# Altium schematic sheet MCU02.SchDoc
size A4
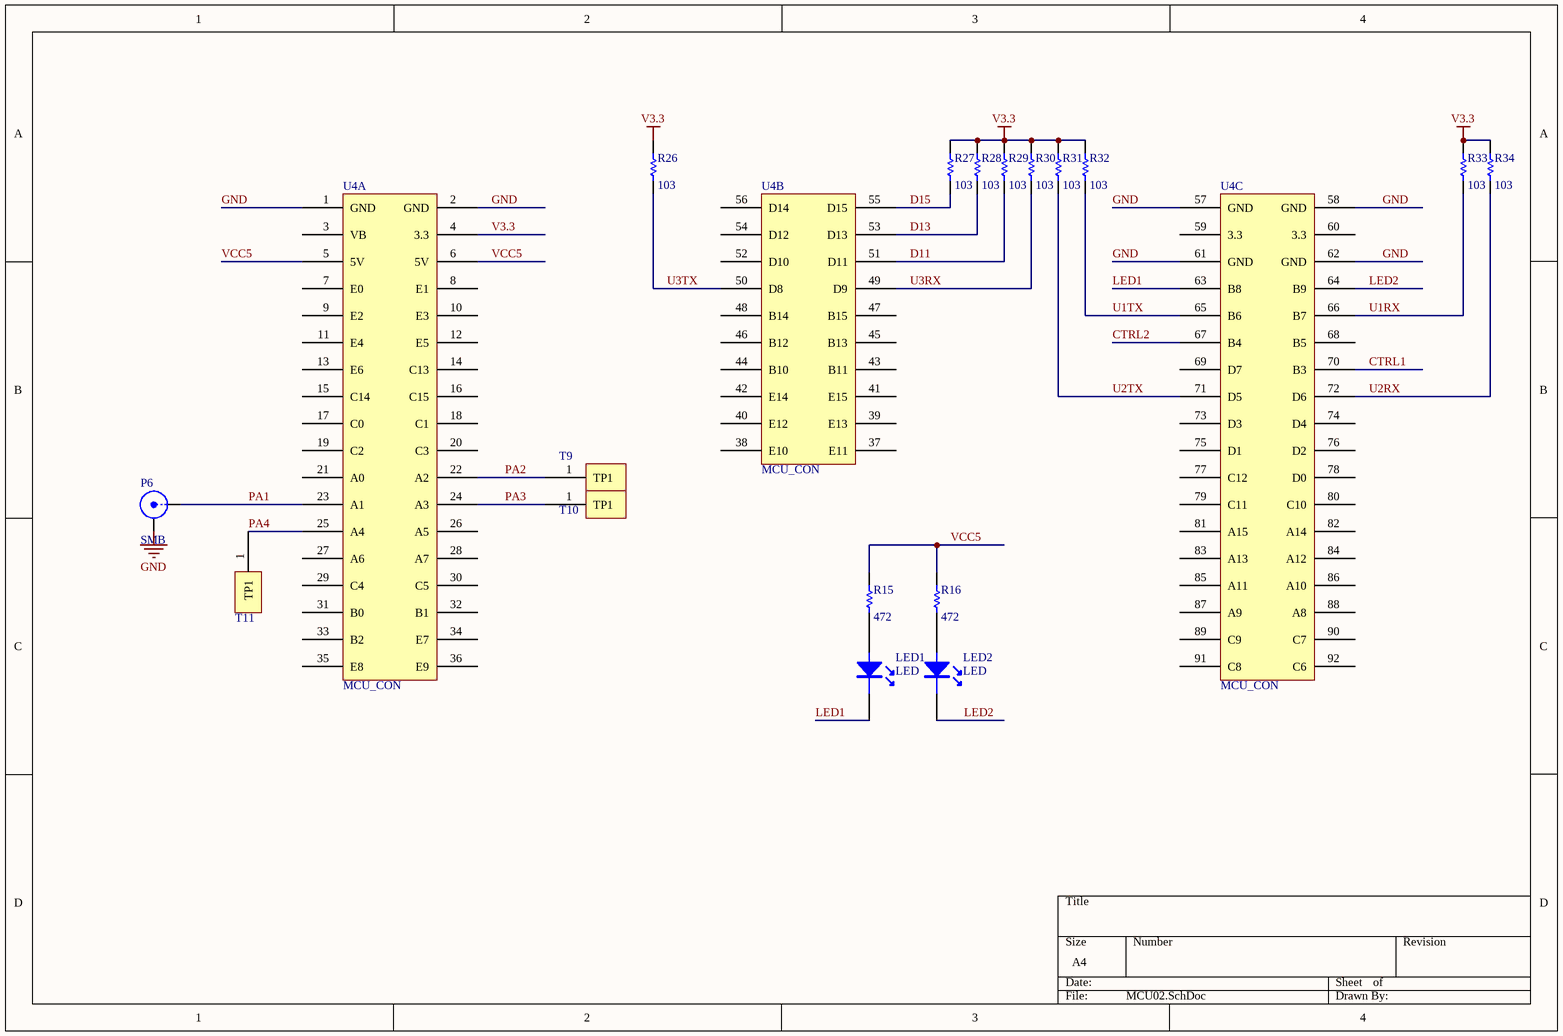
[diagram p0: MCU02.SchDoc]

## Parts
LED1  LED  [0805_LED]
LED2  LED  [0805_LED]
P6  SMB  [SMB_V-RJ45]
R15  value 472  [1206]  (hidden comment: Res Semi)
R16  value 472  [1206]  (hidden comment: Res Semi)
R26  value 103  [1206]  (hidden comment: Res Semi)
R27  value 103  [1206]  (hidden comment: Res Semi)
R28  value 103  [1206]  (hidden comment: Res Semi)
R29  value 103  [1206]  (hidden comment: Res Semi)
R30  value 103  [1206]  (hidden comment: Res Semi)
R31  value 103  [1206]  (hidden comment: Res Semi)
R32  value 103  [1206]  (hidden comment: Res Semi)
R33  value 103  [1206]  (hidden comment: Res Semi)
R34  value 103  [1206]  (hidden comment: Res Semi)
T9  TP1  [TP1]  (value not drawn)
T10  TP1  [TP1]  (value not drawn)
T11  TP1  [TP1]  (value not drawn)
U4  MCU_CON  [MCU_CON]  (parts A,B,C of 3)

## Nets
GND: P6.2(Y) U4.1(GND) U4.2(GND) U4.57(GND) U4.58(GND) U4.61(GND) U4.62(GND)
V3.3: R26.2 R27.2 R28.2 R29.2 R30.2 R31.2 R32.2 R33.2 R34.2 U4.4(3.3)
CTRL1: U4.70(B3)
CTRL2: U4.67(B4)
D11: R29.1 U4.51(D11)
D13: R28.1 U4.53(D13)
D15: R27.1 U4.55(D15)
LED1: LED1.2(K) U4.63(B8)
LED2: LED2.2(K) U4.64(B9)
PA1: P6.1(X) U4.23(A1)
PA2: T9.1(TP1) U4.22(A2)
PA3: T10.1(TP1) U4.24(A3)
PA4: T11.1(TP1) U4.25(A4)
U1RX: R33.1 U4.66(B7)
U1TX: R32.1 U4.65(B6)
U2RX: R34.1 U4.72(D6)
U2TX: R31.1 U4.71(D5)
U3RX: R30.1 U4.49(D9)
U3TX: R26.1 U4.50(D8)
VCC5: R15.2 R16.2 U4.5(5V) U4.6(5V)
NetLED1_1: LED1.1(A) R15.1
NetLED2_1: LED2.1(A) R16.1

Not connected (* = marked no-connect by the designer): U4 3(VB) 7(E0) 8(E1) 9(E2) 10(E3) 11(E4) 12(E5) 13(E6) 14(C13) 15(C14) 16(C15) 17(C0) 18(C1) 19(C2) 20(C3) 21(A0) 26(A5) 27(A6) 28(A7) 29(C4) 30(C5) 31(B0) 32(B1) 33(B2) 34(E7) 35(E8) 36(E9) 37(E11) 38(E10) 39(E13) 40(E12) 41(E15) 42(E14) 43(B11) 44(B10) 45(B13) 46(B12) 47(B15) 48(B14) 52(D10) 54(D12) 56(D14) 59(3.3) 60(3.3) 68(B5) 69(D7) 73(D3) 74(D4) 75(D1) 76(D2) 77(C12) 78(D0) 79(C11) 80(C10) 81(A15) 82(A14) 83(A13) 84(A12) 85(A11) 86(A10) 87(A9) 88(A8) 89(C9) 90(C7) 91(C8) 92(C6)

## Library data of the parts
P6 = SMB: SMB Straight Connector; LatestRevisionDate: 17-Jul-2002; LatestRevisionNote: Re-released for DXP Platform.; Publisher: Altium Limited
R15 R16 R26-R34 = Res Semi: Semiconductor Resistor; Published: 8-Jun-2000; LatestRevisionDate: 17-Jul-2002; LatestRevisionNote: Re-released for DXP Platform.; PackageReference: AXIAL-0.5; Publisher: Altium Limited